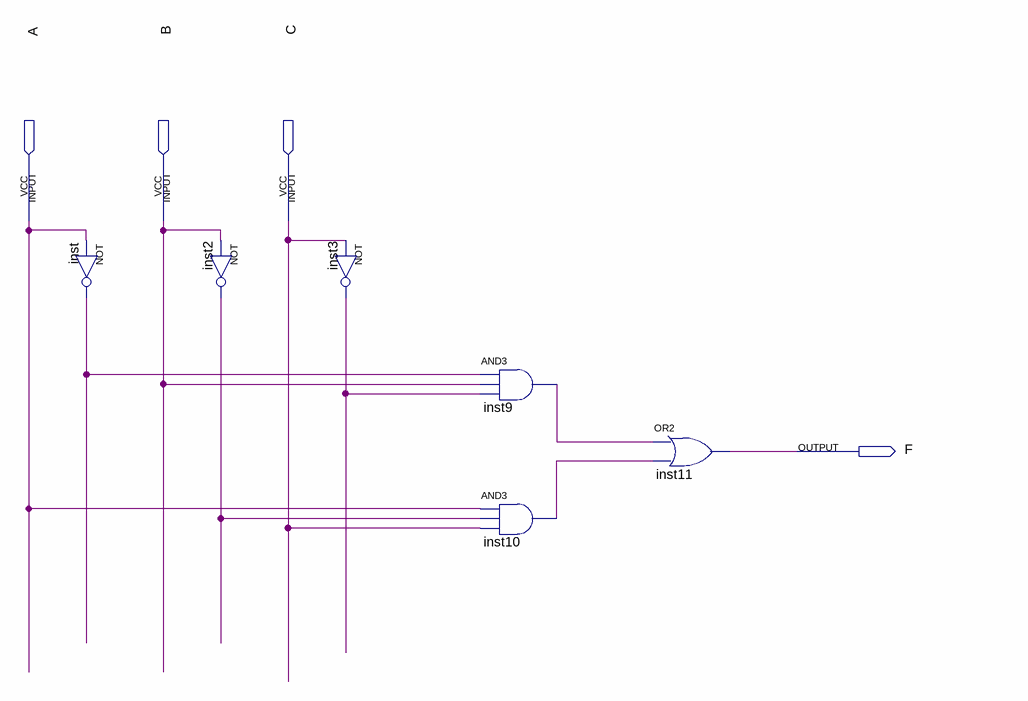
[diagram p0: schematic sheet]
// Quartus schematic outnotin.bdf as structural Verilog: 6 symbols, 4 pins
module outnotin (
  input  A,
  input  B,
  input  C,
  output F
);

  wire inst2_out, inst3_out, inst9_out, inst10_out, inst_out;

  not inst (inst_out, A);
  not inst2 (inst2_out, B);
  not inst3 (inst3_out, C);
  and inst9 (inst9_out, inst_out, B, inst3_out);
  and inst10 (inst10_out, A, inst2_out, C);
  or inst11 (F, inst9_out, inst10_out);
endmodule
